# EasyEDA Pro project ProPrj_单片机制板_2025-12-27.epro

# Schematic Schematic2
Assembly Variant: Basic; Board Name: Board1; Create Date: 2025-12-16; Page Name: P1; Project Name: 单片机制板; Schematic Name: Schematic2; Update Date: 2025-12-16; BladeWidth: 10; Company: 嘉立创EDA; Page Size: A4; RegionStart: 1; ShowBorder: 1; TitleBlock: 0; TitleBlockPosition: 3; Version: V1.0; XRegionCount: 6; YRegionCount: 4
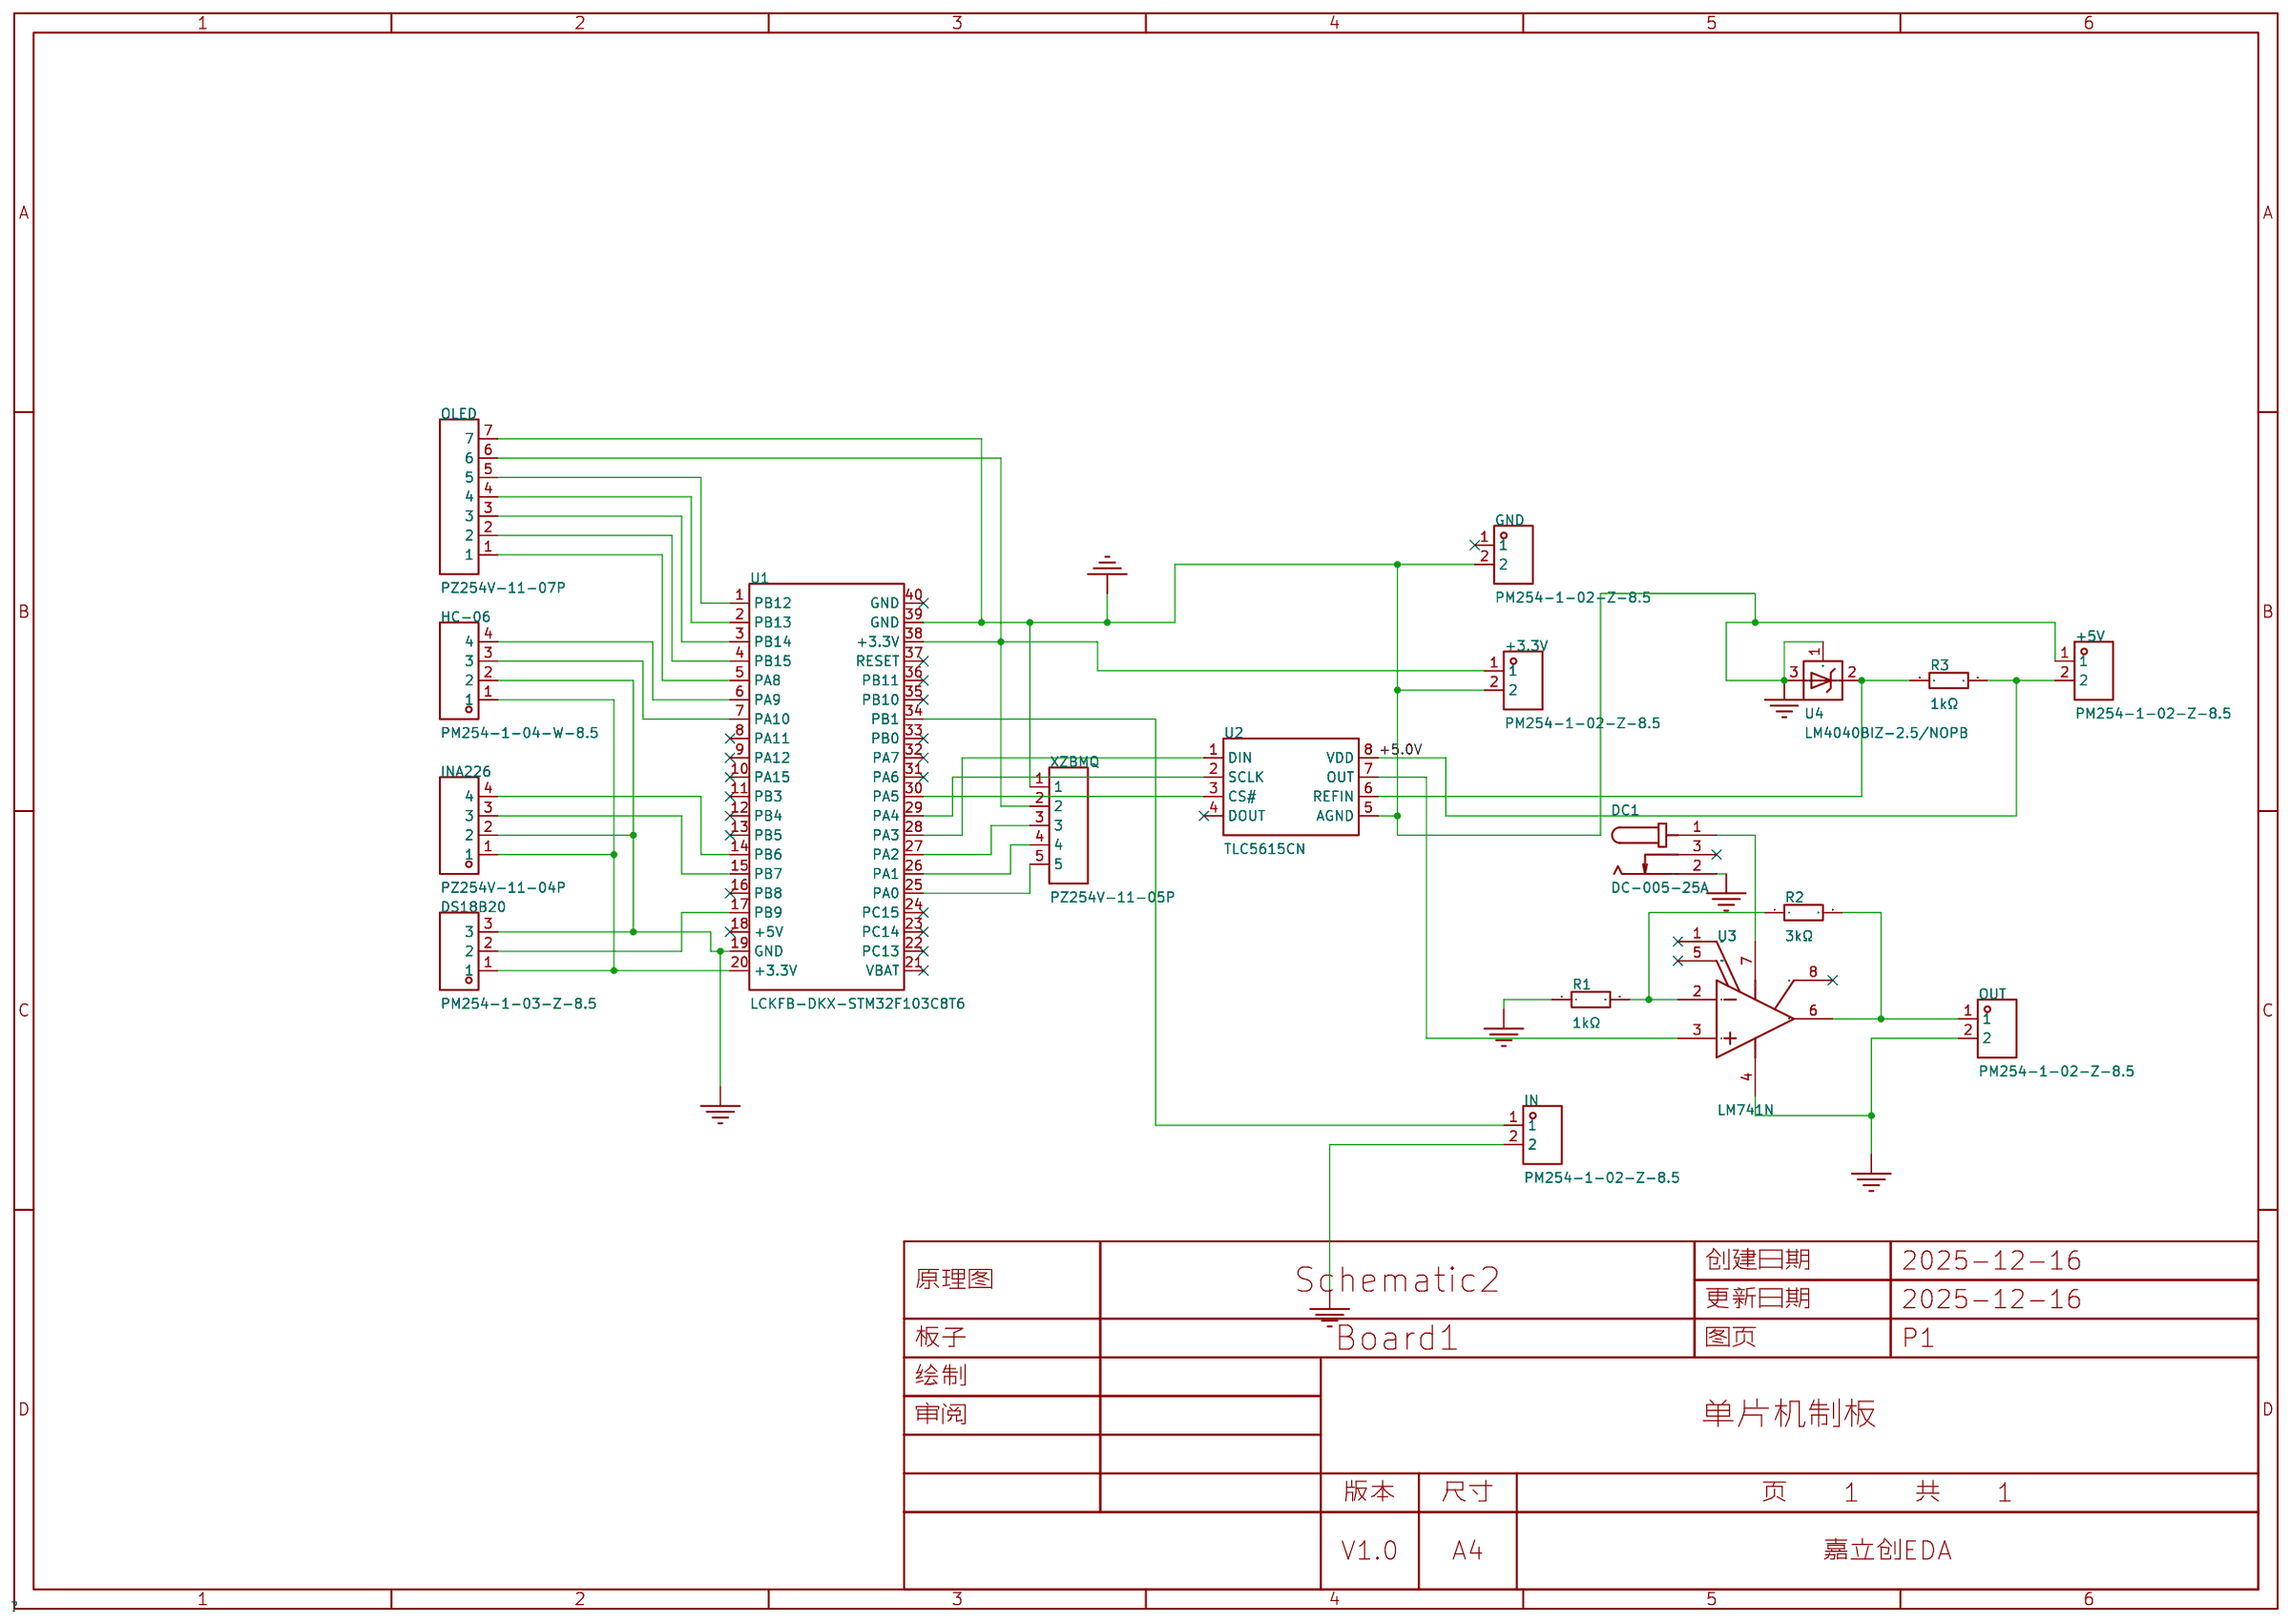
[diagram p0: schematic sheet]

## Parts
+3.3V  PM254-1-02-Z-8.5  [HDR-TH_2P-P2.54-V-F]
+5V  PM254-1-02-Z-8.5  [HDR-TH_2P-P2.54-V-F]
DC1  DC-005-25A  [DC-IN-TH_DC005]
DS18B20  PM254-1-03-Z-8.5  [HDR-TH_3P-P2.54-V-F]
GND  PM254-1-02-Z-8.5  [HDR-TH_2P-P2.54-V-F]
HC-06  PM254-1-04-W-8.5  [HDR-TH_4P-P2.54-H-F-W10.0-N]
IN  PM254-1-02-Z-8.5  [HDR-TH_2P-P2.54-V-F]
INA226  PZ254V-11-04P  [HDR-TH_4P-P2.54-V-M]
OLED  PZ254V-11-07P  [HDR-TH_7P-P2.54-V-M]
OUT  PM254-1-02-Z-8.5  [HDR-TH_2P-P2.54-V-F]
R1  1kΩ  [RES-TH_BD2.5-L6.5-P10.50-D0.6]
R2  3kΩ  [RES-TH_BD1.9-L3.3-P7.30-D0.5]
R3  1kΩ  [RES-TH_BD2.5-L6.5-P10.50-D0.6]
U1  LCKFB-DKX-STM32F103C8T6  [CONN-TH_L53.3-W22.9_STM32F103C8T6-CARD]
U2  TLC5615CN  [PDIP-8_L9.3-W6.4-P2.54-LS7.9-BL-1_1]
U3  LM741N  [DIP-8_L9.3-W6.4-P2.54-LS7.6-BL]
U4  LM4040BIZ-2.5/NOPB  [TO-92-3_L4.9-W3.7-P1.27-L_1]
XZBMQ  PZ254V-11-05P  [HDR-TH_5P-P2.54-V-M]

## Library data of the parts
+3.3V +5V GND IN OUT = PM254-1-02-Z-8.5: 插孔结构:1x2P;间距:2.54mm;行距:-;圆孔/方孔:方孔;安装方式:直插;排数:单排;总孔位数:2P;额定电流:3A;额定电压:-;插孔方向:顶部;塑高:8.5mm;触头材质:铜合金;工作温度:-40℃~+105℃;; LCSC Part Name: 1x2P 间距:2.54mm 直插; Supplier Part: C2897365; Manufacturer: HCTL(华灿天禄); Supplier Footprint: 插件,P=2.54mm; JLCPCB Part Class: Extended Part; Datasheet: https://item.szlcsc.com/datasheet/PM254-1-02-Z-8.5/3142370.html; Supplier: LCSC; Holes Structure: 1x2P; Pitch: 2.54mm; Circular Hole / Square Hole: 方孔; Mounting Type: 直插; Number of Rows: 单排; Number of Positions: 2P; Current Rating: 3A; Holes Direction: 顶部; Insulation Height: 8.5mm; Contact Material: 铜合金; Operating Temperature: -40℃~+105℃
DC1 = DC-005-25A: 连接器类型:DC电源插座;安装方式:弯插;触点内径:2.5mm;触点外径:6.4mm;额定电流:500mA;额定电压:30V;工作温度:-25℃~+80℃;; LCSC Part Name: DC电源插座 内径:2.5mm 外径:6.4mm; Supplier Part: C136715; Manufacturer: 韩国韩荣; Supplier Footprint: 插件; JLCPCB Part Class: Extended Part; Datasheet: https://item.szlcsc.com/datasheet/DC-005-25A/148031.html; Supplier: LCSC; Connector Type: DC电源插座; Mounting Type: 弯插; Inside Contact Diameter: 2.5mm; Outside Contact Diameter: 6.4mm; Current Rating: 500mA; Voltage Rating (Max): 30V; Operating Temperature: -25℃~+80℃
DS18B20 = PM254-1-03-Z-8.5: 插孔结构:1x3P;间距:2.54mm;行距:-;圆孔/方孔:方孔;安装方式:直插;排数:单排;总孔位数:3P;额定电流:3A;额定电压:-;插孔方向:顶部;塑高:8.5mm;触头材质:铜合金;工作温度:-40℃~+105℃;; LCSC Part Name: 1x3P 间距:2.54mm 直插; Supplier Part: C2897366; Manufacturer: HCTL(华灿天禄); Supplier Footprint: 插件,P=2.54mm; JLCPCB Part Class: Extended Part; Datasheet: https://item.szlcsc.com/datasheet/PM254-1-03-Z-8.5/3142371.html; Supplier: LCSC; Holes Structure: 1x3P; Pitch: 2.54mm; Circular Hole / Square Hole: 方孔; Mounting Type: 直插; Number of Rows: 单排; Number of Positions: 3P; Current Rating: 3A; Holes Direction: 顶部; Insulation Height: 8.5mm; Contact Material: 铜合金; Operating Temperature: -40℃~+105℃
HC-06 = PM254-1-04-W-8.5: 插孔结构:1x4P;间距:2.54mm;行距:-;圆孔/方孔:方孔;安装方式:弯插;排数:单排;总孔位数:4P;额定电流:3A;额定电压:-;插孔方向:侧面;塑高:8.5mm;触头材质:铜合金;工作温度:-40℃~+105℃;; LCSC Part Name: 1x4P 间距:2.54mm 弯插; Supplier Part: C2897386; Manufacturer: HCTL(华灿天禄); Supplier Footprint: 弯插,P=2.54mm; JLCPCB Part Class: Extended Part; Datasheet: https://item.szlcsc.com/datasheet/PM254-1-04-W-8.5/3142391.html; Supplier: LCSC; Holes Structure: 1x4P; Pitch: 2.54mm; Circular Hole / Square Hole: 方孔; Mounting Type: 弯插; Number of Rows: 单排; Number of Positions: 4P; Current Rating: 3A; Holes Direction: 侧面; Insulation Height: 8.5mm; Contact Material: 铜合金; Operating Temperature: -40℃~+105℃
INA226 = PZ254V-11-04P: 插针结构:1x4P;间距:2.54mm;行距:-;圆针/方针:方针;安装方式:直插;排数:单排;总PIN位数:4P;额定电流:3A;额定电压:250V;配合针长度:6mm;塑高:2.5mm;端接针长度:3mm;触头材质:-;工作温度:-40℃~+105℃;颜色:黑色;; LCSC Part Name: 1x4P 间距:2.54mm 方针 直插; Supplier Part: C2691448; Manufacturer: XFCN(兴飞); Supplier Footprint: 插件,P=2.54mm; JLCPCB Part Class: Extended Part; Datasheet: https://item.szlcsc.com/datasheet/PZ254V-11-04P/2801085.html; Supplier: LCSC; Pin Structure: 1x4P; Pitch: 2.54mm; Circluar Pins/Square Pins: 方针; Mounting Type: 直插; Number of Rows: 单排; Number of Pins: 4P; Current Rating: 3A; Voltage Rating (Max): 250V; Length of Mating Pin: 6mm; Insulation Height: 2.5mm; Length of End Connection Pin: 3mm; Operating Temperature: -40℃~+105℃; Color: 黑色
OLED = PZ254V-11-07P: 插针结构:1x7P;间距:2.54mm;行距:-;圆针/方针:方针;安装方式:直插;排数:单排;总PIN位数:7P;额定电流:-;额定电压:-;配合针长度:6mm;塑高:2.5mm;端接针长度:3mm;触头材质:黄铜;触头镀层:-;工作温度:-40℃~+105℃;颜色:黑色;; LCSC Part Name: 1x7P 间距:2.54mm 方针 直插; Supplier Part: C492406; Manufacturer: XFCN(兴飞); Supplier Footprint: 插件,P=2.54mm; JLCPCB Part Class: Extended Part; Datasheet: https://atta.szlcsc.com/upload/public/pdf/source/20200309/C492406_654C533EE691117E22DD9F76C114C2D9.pdf; Supplier: LCSC; Pin Structure: 1x7P; Pitch: 2.54mm; Circluar Pins/Square Pins: 方针; Mounting Type: 直插; Number of Rows: 单排; Number of Pins: 7P; Length of Mating Pin: 6mm; Insulation Height: 2.5mm; Length of End Connection Pin: 3mm; Contact Material: 黄铜; Operating Temperature: -40℃~+105℃; Color: 黑色
R1 R3 = MFR0W4F1001A50: 电阻类型:金属膜电阻;阻值:1kΩ;精度:±1%;功率:250mW;温度系数:±50ppm/℃;; LCSC Part Name: 1kΩ ±1% 250mW 金属膜电阻 铜脚，圆柱状直插; Supplier Part: C57435; Manufacturer: UNI-ROYAL(厚声); Supplier Footprint: 插件,D2.2xL6.5mm; JLCPCB Part Class: Extended Part; Datasheet: https://atta.szlcsc.com/upload/public/pdf/source/20191012/C436293_8820AA14BC71FA35E551C06C441482A0.pdf; Supplier: LCSC; Type: 金属膜电阻; Tolerance: ±1%; Voltage-Supply(Max): 250V; Power(Watts): 250mW; Temperature Coefficient: ±50ppm/℃
R2 = MFR-12FTE52-3K: 电阻类型:金属膜电阻;阻值:3kΩ;精度:±1%;功率:166.667mW;温度系数:±50ppm/℃;; LCSC Part Name: 金属膜电阻 3kΩ ±1% 166.667mW; Supplier Part: C172902; Manufacturer: YAGEO(国巨); Supplier Footprint: 插件,D1.9xL3.4mm; JLCPCB Part Class: Extended Part; Datasheet: https://atta.szlcsc.com/upload/public/pdf/source/20191118/C457825_18355E864DE4965678DC27B0EBC3E21E.pdf; Supplier: LCSC; Type: 金属膜电阻; Tolerance: ±1%; Power(Watts): 166.667mW; Temperature Coefficient: ±50ppm/℃; Operating Temperature: -55℃~+155℃
U1 = LCKFB-DKX-STM32F103C8T6: 搭载Contex M3内核,程序存储容量64KB,RAM总容量20KB,最高72MHz主频,提供高效的计算能力和稳定的运行环境。; LCSC Part Name: 立创·地阔星-STM32F103C8T6开发板; Supplier Part: C22396880; Manufacturer: 立创开发板; JLCPCB Part Class: Extended Part; Datasheet: https://item.szlcsc.com/datasheet/LCKFB-DKX-STM32F103C8T6/24005615.html; Supplier: LCSC
U2 = TLC5615CN_1: Supplier Part: C5310753; Manufacturer: HGSEMI(华冠); Supplier Footprint: DIP-8; JLCPCB Part Class: Extended Part; Datasheet: https://atta.szlcsc.com/upload/public/pdf/source/20230411/671D91139559B6A26F2828B5A4EE5D00.pdf; Supplier: LCSC; Resolution(Bits): 10位; Number of Channels: 1; Interface: 串行; Voltage - Supply: 4.5V~5.5V; Settling Time: 12.5us; Output Type: 电压-缓冲; Integral non - linearity: 1LSB; Operating Temperature: 0℃~+70℃
U3 = LM741N: 放大器数:单路;轨到轨:-;增益带宽积(GBP):1.5MHz;输入失调电压(Vos):5mV;压摆率(SR):500V/ms;输入偏置电流(Ib):500nA;; LCSC Part Name: LM741通用运算放大器; Supplier Part: C22446595; Manufacturer: HGSEMI(华冠); Supplier Footprint: DIP-8; JLCPCB Part Class: Extended Part; Datasheet: https://item.szlcsc.com/datasheet/LM741N/24099143.html; Supplier: LCSC; Number of Channels: 单路; Maximum Power Supply Range (Vdd-Vss): 36V; Gain Bandwidth Product: 1.5MHz; Vos - Input Offset Voltage: 5mV; Input Offset Voltage Drift(Vos TC): 15uV/℃; Slew Rate: 500V/ms; Ib - Input Bias Current: 500nA; Input Offset Current(Ios): 200nA; Common Mode Rejection Ratio(CMRR): 90dB; Quiescent Current: 1.7mA; Output Current: 25mA; Operating Temperature: 0℃~+70℃; Dual Supply: -15V~15V
U4 = LM4040BIZ-2.5/NOPB: 输出类型:固定;输入电压:-;输出电压:2.5V;输出电流:15mA;精度:±0.2%;; Supplier Part: C1575351; Manufacturer: TI(德州仪器); Supplier Footprint: TO-92-3; JLCPCB Part Class: 扩展库; Datasheet: https://www.ti.com/cn/lit/gpn/lm4040-n; Supplier: LCSC; Output Type: 固定; Output Voltage: 2.5V; Output Current: 15mA; Tolerance: ±0.2%; Temperature Coefficient: 100ppm/℃; Reference Type: 并联; Noise - 10Hz to 10kHz: 35uVrms; Operating Temperature: -40℃~+85℃@(Ta)
XZBMQ = PZ254V-11-05P: 插针结构:1x5P;间距:2.54mm;行距:-;圆针/方针:方针;安装方式:直插;排数:单排;总PIN位数:5P;额定电流:-;额定电压:-;配合针长度:6mm;塑高:2.5mm;端接针长度:3mm;触头材质:黄铜;触头镀层:-;工作温度:-40℃~+105℃;颜色:黑色;; LCSC Part Name: 1x5P 间距:2.54mm 方针 直插; Supplier Part: C492404; Manufacturer: XFCN(兴飞); Supplier Footprint: 插件,P=2.54mm; JLCPCB Part Class: Extended Part; Datasheet: https://item.szlcsc.com/datasheet/PZ254V-11-05P/502960.html; Supplier: LCSC; Pin Structure: 1x5P; Pitch: 2.54mm; Circluar Pins/Square Pins: 方针; Mounting Type: 直插; Number of Rows: 单排; Number of Pins: 5P; Length of Mating Pin: 6mm; Insulation Height: 2.5mm; Length of End Connection Pin: 3mm; Contact Material: 黄铜; Operating Temperature: -40℃~+105℃; Color: 黑色

## Nets
+5.0V: +5V.2 R3.2 U2.8(VDD)
GND: +3.3V.2 +5V.1 DC1.2 DS18B20.3 GND.2 HC-06.2 IN.2 INA226.2 OLED.7 OUT.2 R1.1 U1.19(GND) U1.39(GND) U2.5(AGND) U3.4(V-) U4.1(NC) U4.3(A) XZBMQ.1
$1N2: DS18B20.1 HC-06.1 INA226.1 U1.20(+3.3V)
$1N4: INA226.3 U1.15(PB7)
$1N5: INA226.4 U1.14(PB6)
$1N9: HC-06.3 U1.7(PA10)
$1N10: HC-06.4 U1.6(PA9)
$1N13: OLED.5 U1.1(PB12)
$1N14: OLED.4 U1.2(PB13)
$1N15: OLED.3 U1.3(PB14)
$1N16: OLED.2 U1.4(PB15)
$1N17: OLED.1 U1.5(PA8)
$1N18: U1.27(PA2) XZBMQ.3
$1N19: U1.26(PA1) XZBMQ.4
$1N20: U1.25(PA0) XZBMQ.5
$1N27: U1.28(PA3) U2.1(DIN)
$1N28: U1.29(PA4) U2.2(SCLK)
$1N29: U1.30(PA5) U2.3(CS#)
$1N32: U2.7(OUT) U3.3(+IN)
$1N36: DS18B20.2 U1.17(PB9)
$1N39: IN.1 U1.34(PB1)
$1N40: OUT.1 R2.2 U3.6(OUT)
$1N41: DC1.1 U3.7(V+)
$1N42: R1.2 R2.1 U3.2(-IN)
$1N45: R3.1 U2.6(REFIN) U4.2(K)
$1N49: +3.3V.1 OLED.6 U1.38(+3.3V) XZBMQ.2

Not connected (* = marked no-connect by the designer): DC1 3*; GND 1*; U1 8(PA11)* 9(PA12)* 10(PA15)* 11(PB3)* 12(PB4)* 13(PB5)* 16(PB8)* 18(+5V)* 21(VBAT)* 22(PC13)* 23(PC14)* 24(PC15)* 31(PA6)* 32(PA7)* 33(PB0)* 35(PB10)* 36(PB11)* 37(RESET)* 40(GND)*; U2 4(DOUT)*; U3 1(OFFSET NULL)* 5(OFFSET NULL)* 8(NC)*

# Board PCB2
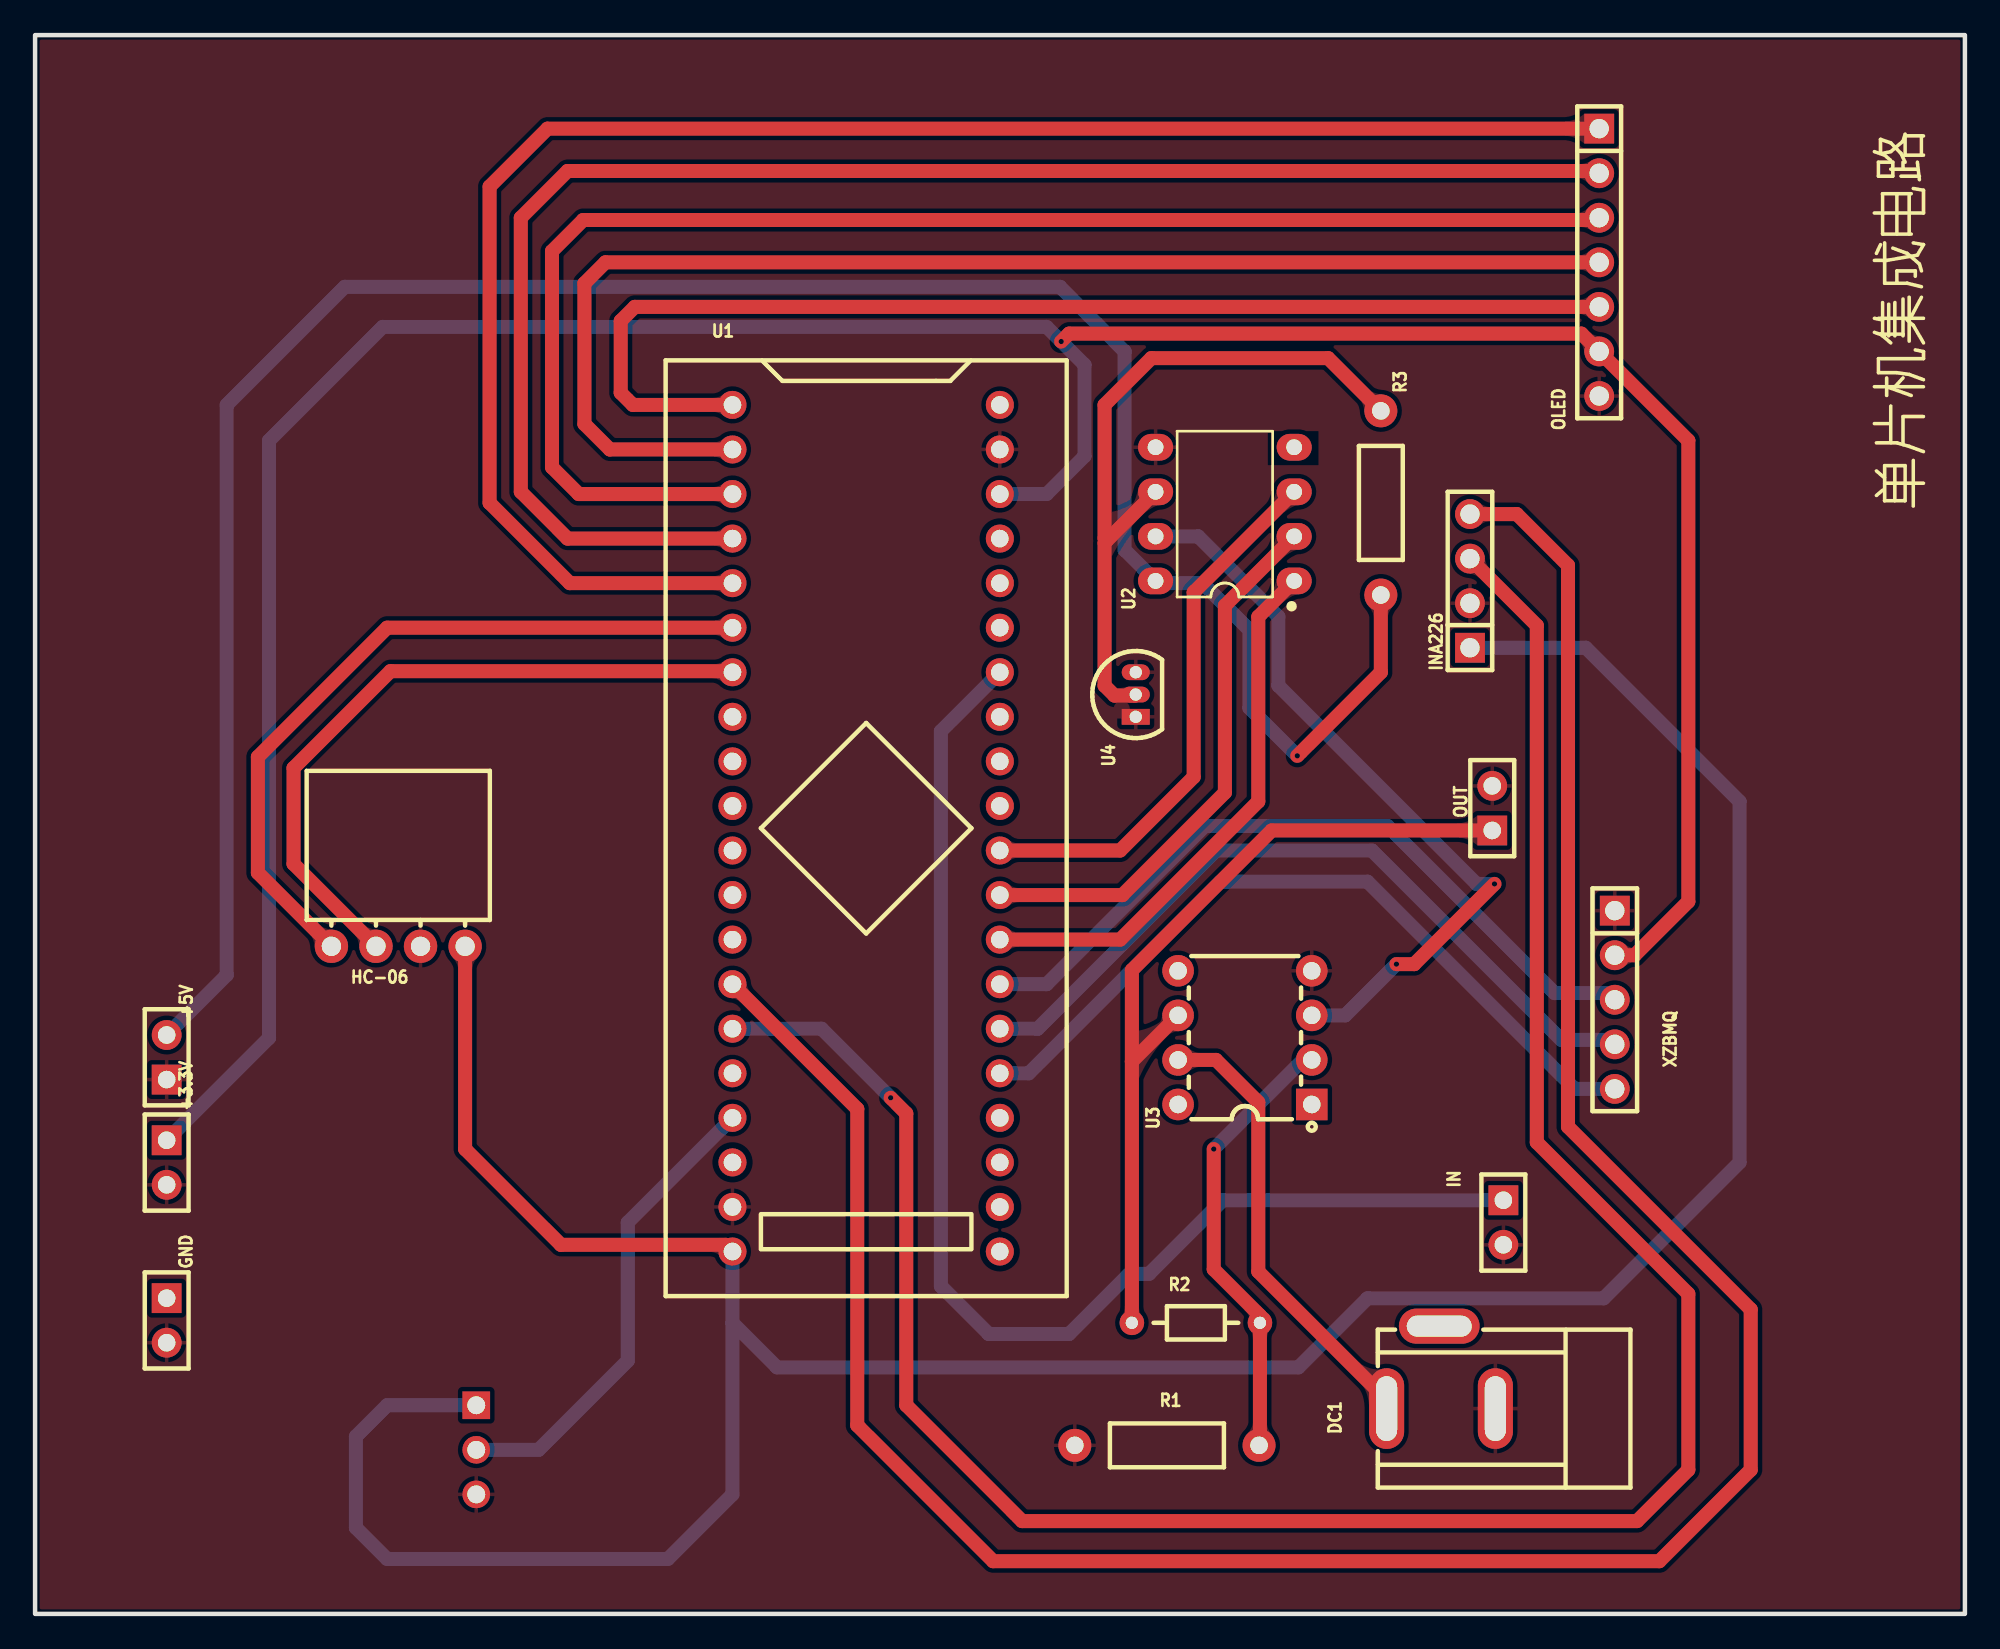
[diagram p1: board, top side]
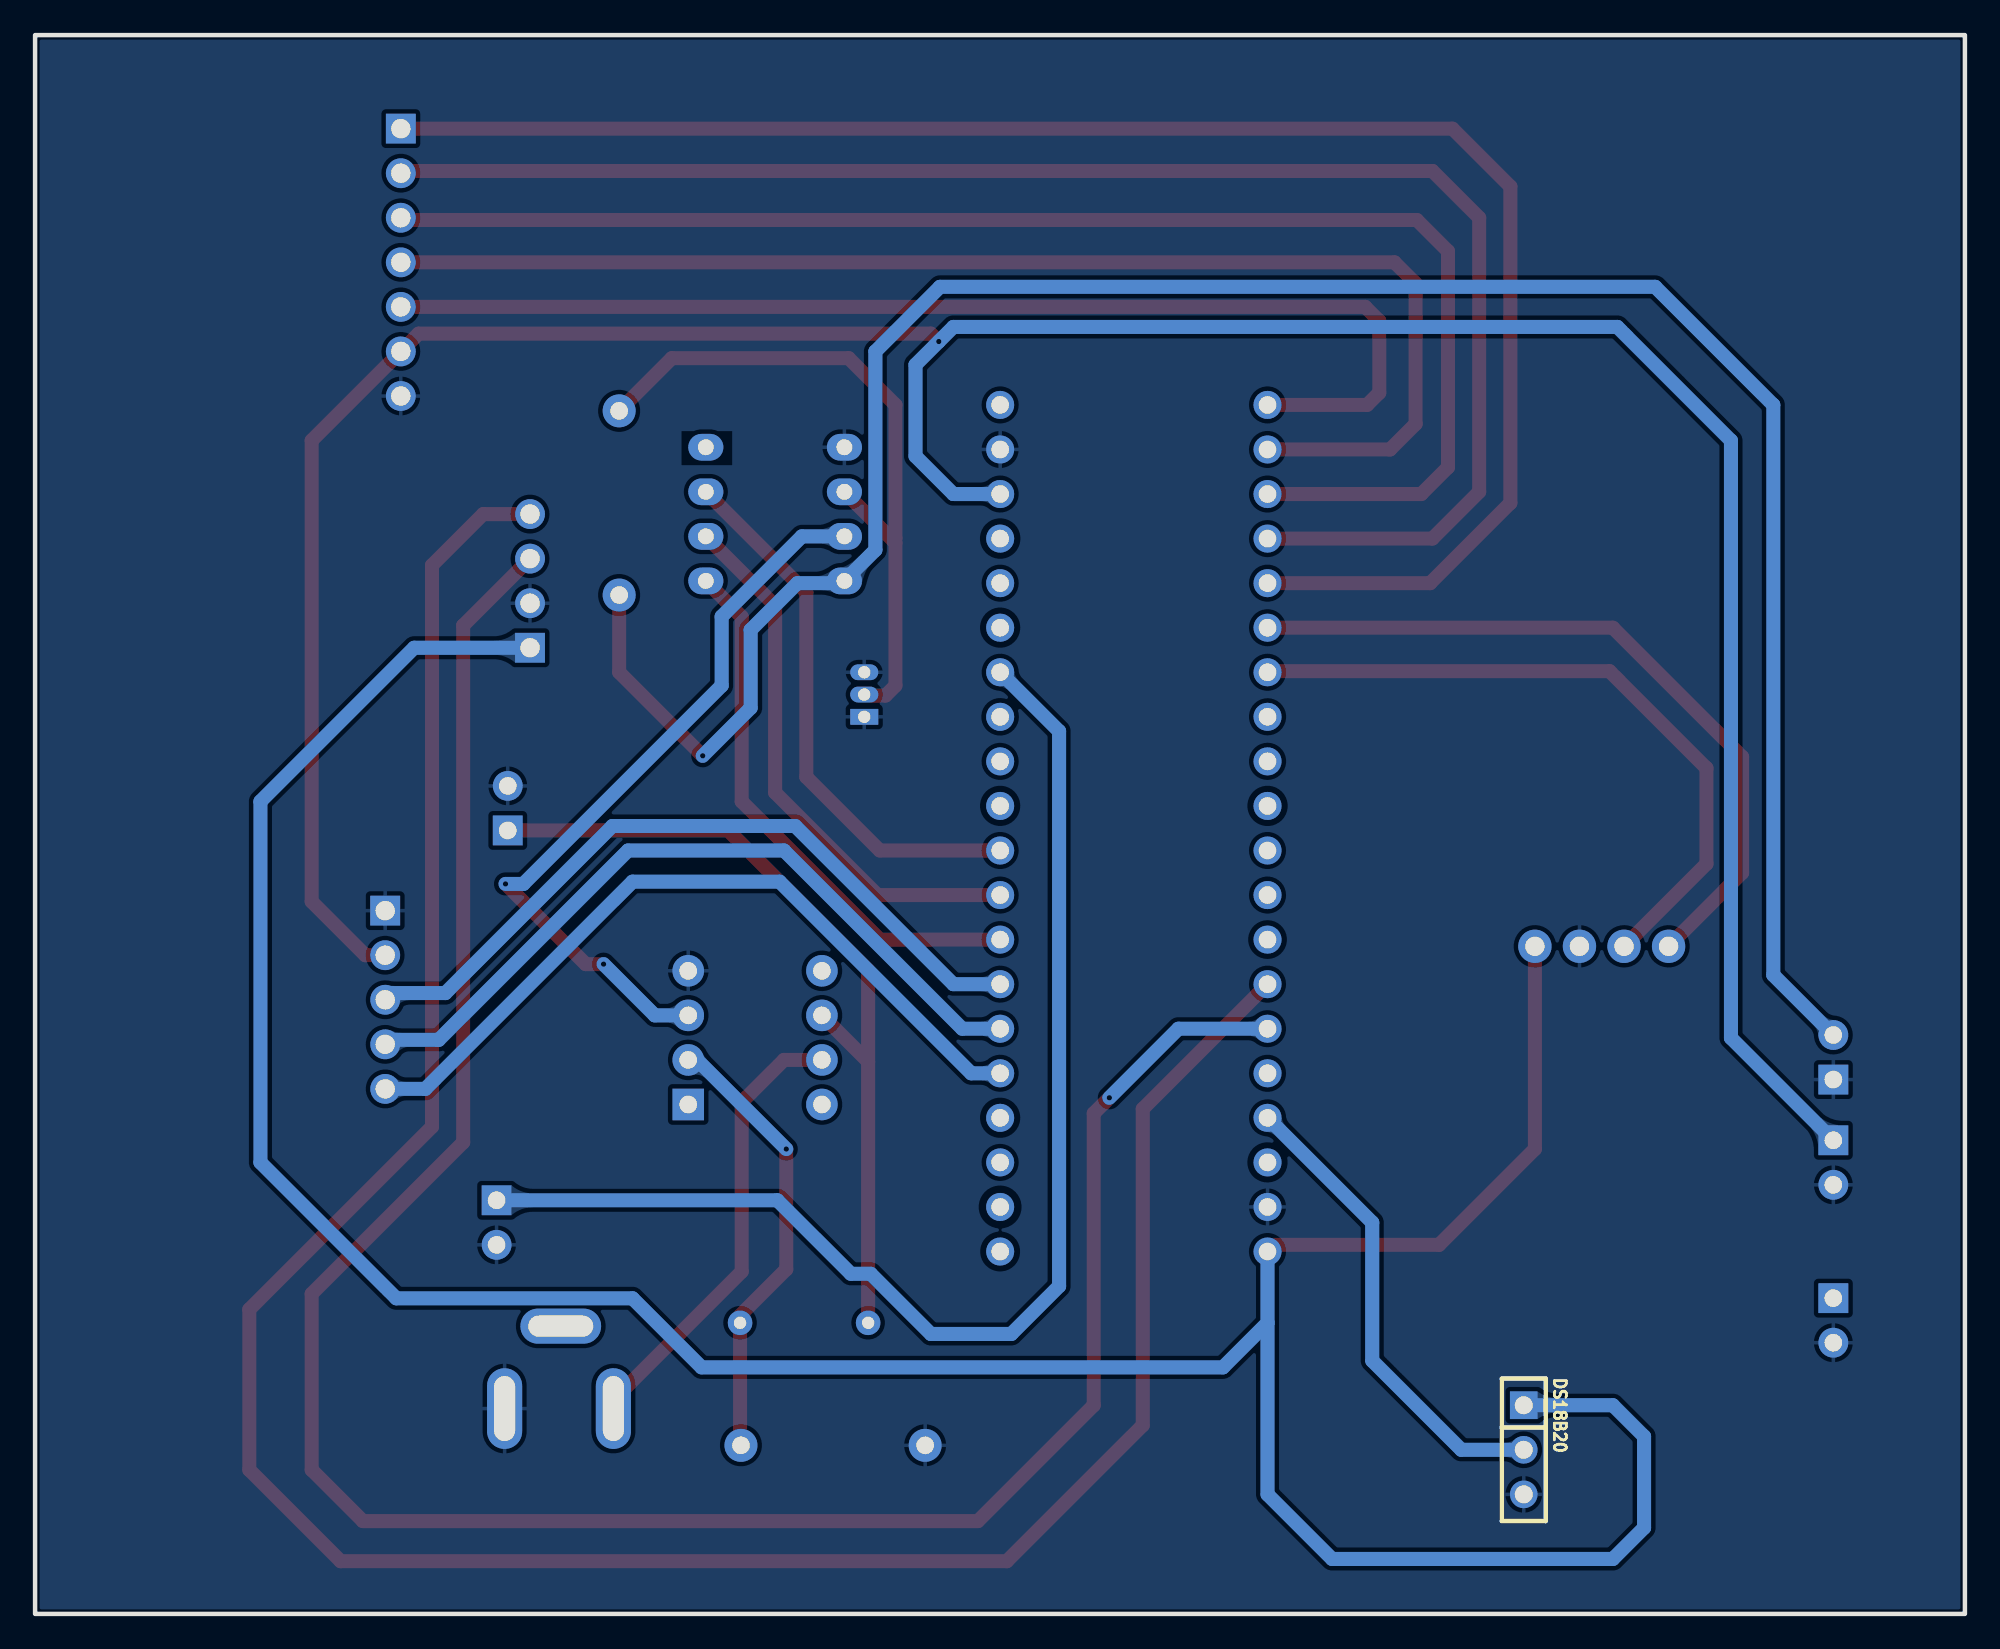
[diagram p2: board, bottom side, seen from below]

Outline 110 x 90 mm; copper layers: Top Layer, Bottom Layer. Coordinates in mm from the lower left corner of the outline.
Outline path: rectangle 0,90 110,0
Stack: Top Layer 0.035mm / Dielectric1 1.51mm FR4 er 4.5 / Bottom Layer 0.035mm

## Design rules (mm)
spacing copperThickness1oz (default): track to track 0.102, other pairs 0.152 to 0.3
spacing copperThickness2oz: track to track 0.203, other pairs 0.152 to 0.3
track width copperThickness1oz (default): min 0.127, default 0.254, max 2.54
track width copperThickness2oz: min 0.203, default 0.254, max 2.54
differential pair differentialPair (default): width min 0.127, default 0.254, max 2.54; gap min 0.152, default 0.152
net GND uses copperRegion

## Placement (name value [footprint] x y rotation side)
+3.3V  PM254-1-02-Z-8.5  [HDR-TH_2P-P2.54-V-F]  7.5 25.73 270 top
+5V  PM254-1-02-Z-8.5  [HDR-TH_2P-P2.54-V-F]  7.5 31.73 90 top
DC1  DC-005-25A  [DC-IN-TH_DC005]  80.14 14.05 180 top
DS18B20  PM254-1-03-Z-8.5  [HDR-TH_3P-P2.54-V-F]  25.15 9.35 270 bottom
GND  PM254-1-02-Z-8.5  [HDR-TH_2P-P2.54-V-F]  7.5 16.73 270 top
HC-06  PM254-1-04-W-8.5  [HDR-TH_4P-P2.54-H-F-W10.0-N]  20.7 38.06 180 top
IN  PM254-1-02-Z-8.5  [HDR-TH_2P-P2.54-V-F]  83.69 22.31 270 top
INA226  PZ254V-11-04P  [HDR-TH_4P-P2.54-V-M]  81.79 58.89 90 top
OLED  PZ254V-11-07P  [HDR-TH_7P-P2.54-V-M]  89.15 77.05 270 top
OUT  PM254-1-02-Z-8.5  [HDR-TH_2P-P2.54-V-F]  83.06 45.93 90 top
R1  1kΩ  [RES-TH_BD2.5-L6.5-P10.50-D0.6]  64.52 9.61 0 top
R2  3kΩ  [RES-TH_BD1.9-L3.3-P7.30-D0.5]  66.17 16.59 180 top
R3  1kΩ  [RES-TH_BD2.5-L6.5-P10.50-D0.6]  76.71 63.33 270 top
U1  LCKFB-DKX-STM32F103C8T6  [CONN-TH_L53.3-W22.9_STM32F103C8T6-CARD]  47.37 44.79 270 top
U2  TLC5615CN  [PDIP-8_L9.3-W6.4-P2.54-LS7.9-BL-1_1]  67.82 62.69 90 top
U3  LM741N  [DIP-8_L9.3-W6.4-P2.54-LS7.6-BL]  68.96 32.85 90 top
U4  LM4040BIZ-2.5/NOPB  [TO-92-3_L4.9-W3.7-P1.27-L_1]  62.74 52.41 90 top
XZBMQ  PZ254V-11-05P  [HDR-TH_5P-P2.54-V-M]  90.04 35.01 270 top

## Footprints (pads in the part's own frame, mm; a bottom-side part is the same pattern mirrored in y, then rotated)
CONN-TH_L53.3-W22.9_STM32F103C8T6-CARD
  round 1.6 hole 1: 1(-24.13,-7.62) 2(-21.59,-7.62) 3(-19.05,-7.62) 4(-16.51,-7.62) 5(-13.97,-7.62) 6(-11.43,-7.62) 7(-8.89,-7.62) 8(-6.35,-7.62) 9(-3.81,-7.62) 10(-1.27,-7.62) 11(1.27,-7.62) 12(3.81,-7.62) 13(6.35,-7.62) 14(8.89,-7.62) 15(11.43,-7.62) 16(13.97,-7.62) 17(16.51,-7.62) 18(19.05,-7.62) 19(21.59,-7.62) 20(24.13,-7.62) 21(24.13,7.62) 22(21.59,7.62) 23(19.05,7.62) 24(16.51,7.62) 25(13.97,7.62) 26(11.43,7.62) 27(8.89,7.62) 28(6.35,7.62) 29(3.81,7.62) 30(1.27,7.62) 31(-1.27,7.62) 32(-3.81,7.62) 33(-6.35,7.62) 34(-8.89,7.62) 35(-11.43,7.62) 36(-13.97,7.62) 37(-16.51,7.62) 38(-19.05,7.62) 39(-21.59,7.62) 40(-24.13,7.62)
DC-IN-TH_DC005
  oval 2x4.6 hole 1.2x3.7: 1(3.1,2.35) 2(-3.1,2.35)
  oval 4.6x2 hole 3.7x1.2: 3(0.1,-2.35)
DIP-8_L9.3-W6.4-P2.54-LS7.6-BL
  rect 1.8x1.8 hole 1: 1(-3.81,-3.81)
  round 1.8 hole 1: 2(-1.27,-3.81) 3(1.27,-3.81) 4(3.81,-3.81) 5(3.81,3.81) 6(1.27,3.81) 7(-1.27,3.81) 8(-3.81,3.81)
HDR-TH_2P-P2.54-V-F
  rect 1.7x1.7 hole 1: 1(-1.27,0)
  round 1.7 hole 1: 2(1.27,0)
HDR-TH_3P-P2.54-V-F
  rect 1.575x1.575 hole 1.02: 1(-2.54,0)
  round 1.575 hole 1.02: 2(0,0) 3(2.54,0)
HDR-TH_4P-P2.54-H-F-W10.0-N
  round 1.9 hole 1.1: 1(-3.81,0) 2(-1.27,0) 3(1.27,0) 4(3.81,0)
HDR-TH_4P-P2.54-V-M
  rect 1.7x1.7 hole 1.1: 1(-3.81,0)
  round 1.7 hole 1.1: 2(-1.27,0) 3(1.27,0) 4(3.81,0)
HDR-TH_5P-P2.54-V-M
  rect 1.7x1.7 hole 1.1: 1(-5.08,0)
  round 1.7 hole 1.1: 2(-2.54,0) 3(0,0) 4(2.54,0) 5(5.08,0)
HDR-TH_7P-P2.54-V-M
  rect 1.7x1.7 hole 1.1: 1(-7.62,0)
  round 1.7 hole 1.1: 2(-5.08,0) 3(-2.54,0) 4(0,0) 5(2.54,0) 6(5.08,0) 7(7.62,0)
PDIP-8_L9.3-W6.4-P2.54-LS7.9-BL-1_1
  oval 1.524x2 hole 0.9: 1(-3.81,-3.95) 2(-1.27,-3.95) 3(1.27,-3.95) 4(3.81,-3.95) 5(3.81,3.95) 6(1.27,3.95) 7(-1.27,3.95) 8(-3.81,3.95)
RES-TH_BD1.9-L3.3-P7.30-D0.5
  round 1.4 hole 0.7: 1(-3.65,0) 2(3.65,0)
RES-TH_BD2.5-L6.5-P10.50-D0.6
  round 1.879 hole 1: 1(-5.25,0) 2(5.25,0)
TO-92-3_L4.9-W3.7-P1.27-L_1
  rect 0.9x1.6 hole 0.7: 1(-1.27,0)
  oval 0.9x1.6 hole 0.7: 2(0,0) 3(1.27,0)

## Nets
As in the schematic.

Pads without a net: DC1 3; GND 1; U1 8 9 10 11 12 13 16 18 21 22 23 24 31 32 33 35 36 37 40; U2 4; U3 1 5 8

## Via types
v1: diameter 0.61, hole 0.305, Top Layer to Bottom Layer, 6 vias

## Routing (per net, layer and track width the routed paths; a pad name or vN(x,y) marks a point on that pad's centre or on a via; arc(x,y) is an arc through that point)
+5.0V: length 132.6
  Top Layer w0.8: v1(71.95,48.92) 76.71,53.68 R3.2
  Bottom Layer w0.8: +5V.2 10.92,36.42 10.92,68.92 17.65,75.65 58.42,75.65 62.1,71.97 62.1,60.65 U2.8 64,58.76 66.55,58.76 69.22,56.09 69.22,51.65 v1(71.95,48.92)
$1N2: length 182.5
  Top Layer w0.8: HC-06.1 24.51,26.5 29.97,21.04 39.37,21.04 U1.20
  Bottom Layer w0.8: 39.75,16.59 42.29,14.05 72.01,14.05 75.95,17.99 89.41,17.99 97.16,25.74 97.16,46.31 88.39,55.08 INA226.1 ; 39.75,16.59 39.75,6.81 36.07,3.13 20.07,3.13 18.29,4.91 18.29,10.12 20.07,11.9 25.15,11.9 ; 39.75,16.59 U1.20
$1N4: length 134.2
  Top Layer w0.8: v1(48.77,29.42) 49.66,28.53 49.66,11.9 56.26,5.29 91.31,5.29 94.23,8.21 94.23,18.25 85.6,26.88 85.6,56.34 INA226.3
  Bottom Layer w0.8: U1.15 44.83,33.36 v1(48.77,29.42)
$1N5: length 147.1
  Top Layer w0.8: INA226.4 84.46,62.69 87.38,59.77 87.38,27.77 97.79,17.36 97.79,8.21 92.58,3 54.61,3 46.86,10.75 46.86,28.79 U1.14
$1N9: length 39.4
  Top Layer w0.8: HC-06.3 14.73,42.76 14.73,48.22 20.26,53.74 39.69,53.74 U1.7
$1N10: length 42.6
  Top Layer w0.8: 16.89,38.06 12.7,42.25 12.7,48.85 20.07,56.22 U1.6
$1N13: length 66.9
  Top Layer w0.8: U1.1 34.07,68.92 33.38,69.61 33.38,73.71 34.18,74.51 OLED.5
$1N14: length 75.4
  Top Layer w0.8: U1.2 32.77,66.38 31.31,67.83 31.31,75.85 32.51,77.05 OLED.4
$1N15: length 83.7
  Top Layer w0.8: OLED.3 89.03,79.46 31.24,79.46 29.46,77.68 29.46,65.36 30.99,63.84 U1.3
$1N16: length 91.4
  Top Layer w0.8: OLED.2 89.03,82.25 30.35,82.25 27.69,79.59 27.69,63.97 30.35,61.3 U1.4
$1N17: length 98.4
  Top Layer w0.8: OLED.1 29.21,84.67 25.91,81.36 25.91,63.33 30.48,58.76 U1.5
$1N18: length 42.9
  Bottom Layer w0.8: U1.27 57.66,35.9 66.68,44.92 77.09,44.92 86.61,35.39 89.66,35.39 XZBMQ.3
$1N19: length 43.8
  Bottom Layer w0.8: XZBMQ.4 89.79,32.72 87,32.72 76.2,43.52 67.31,43.52 57.15,33.36 U1.26
$1N20: length 44.5
  Bottom Layer w0.8: U1.25 56.64,30.82 67.56,41.74 75.95,41.74 87.76,29.93 XZBMQ.5
$1N27: length 31.4
  Top Layer w0.8: U2.1 69.72,56.84 69.72,46.31 61.85,38.44 U1.28
$1N28: length 31.5
  Top Layer w0.8: U1.29 61.98,40.98 67.82,46.82 67.82,57.47 U2.2
$1N29: length 31.4
  Top Layer w0.8: U1.30 61.85,43.52 66.04,47.71 66.04,58.24 U2.3
$1N32: length 43.3
  Top Layer w0.8: v1(83.19,41.61) 78.61,37.04 v1(77.6,37.04)
  Bottom Layer w0.8: v1(83.19,41.61) 82.17,41.61 70.87,52.92 70.87,56.85 66.29,61.42 U2.7 ; U3.3 74.68,34.12 v1(77.6,37.04)
$1N36: length 27.1
  Bottom Layer w0.8: U1.17 33.78,22.31 33.78,14.44 28.7,9.35 DS18B20.2
$1N39: length 72.7
  Bottom Layer w0.8: IN.1 67.69,23.58 63.5,19.39 62.37,19.39 58.94,15.96 54.36,15.96 51.63,18.68 51.63,50.32 U1.34
$1N40: length 47.7
  Top Layer w0.8: R2.2 62.52,31.49 ; 62.52,31.49 62.52,36.69 70.49,44.66 OUT.1 ; 62.52,31.49 U3.6
$1N41: length 26.1
  Top Layer w0.8: DC1.1 77.04,12.2 69.72,19.51 69.72,29.17 67.31,31.58 U3.7
$1N42: length 25.7
  Top Layer w0.8: v1(67.18,26.5) 67.18,19.64 69.82,17.01 R2.1 69.82,9.66 R1.2
  Bottom Layer w0.8: U3.2 72.26,31.58 v1(67.18,26.5)
$1N45: length 40.2
  Top Layer w0.8: R3.1 73.7,71.58 63.63,71.58 60.96,68.92 60.96,61.31 61.09,61.18 ; 61.09,61.18 60.96,61.06 60.96,52.92 61.53,52.35 62.68,52.35 U4.2 ; 61.09,61.18 U2.6
$1N49: length 173.5
  Top Layer w0.8: v1(58.49,72.53) 58.94,72.98 88.14,72.98 OLED.6 94.23,66.89 94.23,40.61 91.17,37.55 XZBMQ.2
  Bottom Layer w0.8: U1.38 57.66,63.84 59.82,66 59.82,71.2 v1(58.49,72.53) 57.66,73.36 19.81,73.36 13.33,66.89 13.33,32.83 +3.3V.1

## Copper pours and planes (outline as drawn; the poured copper is in the pictures)
GND on Top Layer: -6.22,103.72 121.41,103.72 121.41,-30.65 -6.22,-30.65
GND on Bottom Layer: -9.14,101.81 114.43,101.81 114.43,-25.7 -9.14,-25.7

Small or netless copper shapes (teardrops, artwork), in the pictures only: 41 on Top Layer, 21 on Bottom Layer

## Text on the board
Top Silkscreen Layer: 单片机集成电路
